# EAGLE design picstick_25k50_v1 (EAGLE 7.2.0)
pickstick - open source hardware
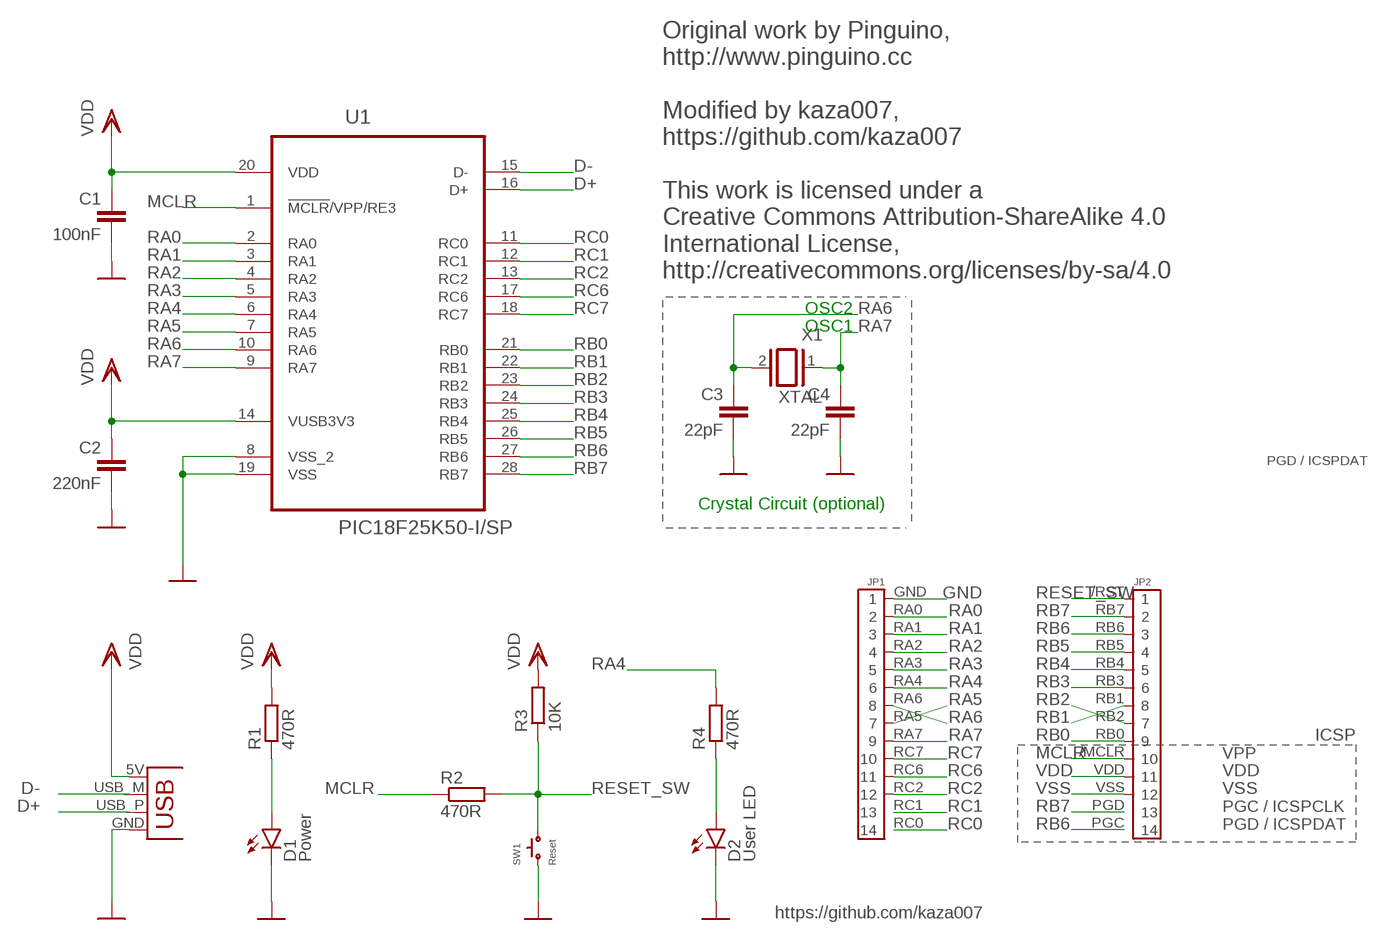
[diagram p0: schematic, sheet 1]

## Parts
C1  100nF  C-EU050-024X044  [C050-024X044]
C2  220nF  C-EU050-024X044  [C050-024X044]
C3  22pF  C-EU025-024X044  [C025-024X044]
C4  22pF  C-EU025-024X044  [C025-024X044]
D1  Power  LED3MM  [LED3MM]
D2  User LED  LED3MM  [LED3MM]
JP1  CONN-14P-PICSTICK-JP1  [PICSTICK_JP1]
JP2  CONN-14P-PICSTICK-JP2  [PICSTICK_JP2]
R1  470R  R-EU_0204/7  [0204/7]
R2  470R  R-EU_0204/7  [0204/7]
R3  10K  R-EU_0204/7  [0204/7]
R4  470R  R-EU_0204/7  [0204/7]
SW1  Reset  SKHLAAA010  [SKHLAAA010]
U1  PIC18F25K50-I/SP  [DIP254P762X406-28P]
USB  FREETRONICS-MASTER-V1_USBPCB  [FREETRONICS-MASTER-V1_USB-A-PCB]
X1  XTAL  XTAL/S  [QS]

## Nets
D+: U1.16(D+) USB.USB_P(D+)
D-: U1.15(D-) USB.USB_M(D-)
GND: C1.2 C2.2 C3.2 C4.2 D1.K(C) D2.K(C) JP1.GND SW1.1 U1.8(VSS_2) U1.19(VSS) USB.GND
MCLR: JP2./MCLR R2.1 U1.1(!MCLR!/VPP/RE3)
N$1: D1.A R1.1
N$6: D2.A R4.1
RA0: JP1.RA0 U1.2(RA0)
RA1: JP1.RA1 U1.3(RA1)
RA2: JP1.RA2 U1.4(RA2)
RA3: JP1.RA3 U1.5(RA3)
RA4: JP1.RA4 R4.2 U1.6(RA4)
RA5: JP1.RA5 U1.7(RA5)
RA6: C3.1 JP1.RA6 U1.10(RA6) X1.2
RA7: C4.1 JP1.RA7 U1.9(RA7) X1.1
RB0: JP2.RB0 U1.21(RB0)
RB1: JP2.RB1 U1.22(RB1)
RB2: JP2.RB2 U1.23(RB2)
RB3: JP2.RB3 U1.24(RB3)
RB4: JP2.RB4 U1.25(RB4)
RB5: JP2.RB5 U1.26(RB5)
RB6: JP2.PGC JP2.RB6 U1.27(RB6)
RB7: JP2.PGD JP2.RB7 U1.28(RB7)
RC0: JP1.RC0 U1.11(RC0)
RC1: JP1.RC1 U1.12(RC1)
RC2: JP1.RC2 U1.13(RC2)
RC6: JP1.RC6 U1.17(RC6)
RC7: JP1.RC7 U1.18(RC7)
RESET_SW: JP2./RST R2.2 R3.1 SW1.2
VDD: C1.1 C2.1 JP2.VDD R1.2 R3.2 U1.14(VUSB3V3) U1.20(VDD) USB.5V(VBUS)
VSS: JP2.VSS

## Notes on the sheet
- Original work by Pinguino,
  http://www.pinguino.cc
  
  Modified by kaza007,
  https://github.com/kaza007
  
  This work is licensed under a 
  Creative Commons Attribution-ShareAlike 4.0
  International License,
  http://creativecommons.org/licenses/by-sa/4.0
- OSC2
- OSC1
- PGD / ICSPDAT
- Crystal Circuit (optional)
- ICSP
- VPP
- PGC / ICSPCLK
- PGD / ICSPDAT
- https://github.com/kaza007

## Library data of the parts
C1-C4 = rcl:C-EU: CAPACITOR, European symbol
D1 D2 = gm-diodes:LED
JP1 JP2 = pinconn:CONN-14P
R1-R4 = rcl:R-EU_: RESISTOR, European symbol
SW1 = alps:SKHLAAA010
U1 = arthur:PIC18F25K50-I/SP: IC, MCU, 8BIT, 32KB FLASH, 28SPDIP; MPN: PIC18F25K50-I/SP; OC_FARNELL: 2305832; OC_NEWARK: 06W2973; PACKAGE: 28SPDIP; SUPPLIER: Microchip
USB = LeoStick:FREETRONICS-MASTER-V1_USB: USB Connectors USB-B-PTH is fully proven SKU : PRT-00139 USB-miniB is fully proven SKU : PRT-00587 USB-A-PCB is untested. USB-A-H is throughly reviewed, but untested. Spark Fun Electronics SKU : PRT-00437 USB-B-SMT is throughly reviewed, but untested. Needs silkscreen touching up. USB-A-S has not been used/tested USB-MB-H has not been used/tested
X1 = special:XTAL/S: CRYSTAL

## Net classes
0 default: clearance 0.205 mm

## Board
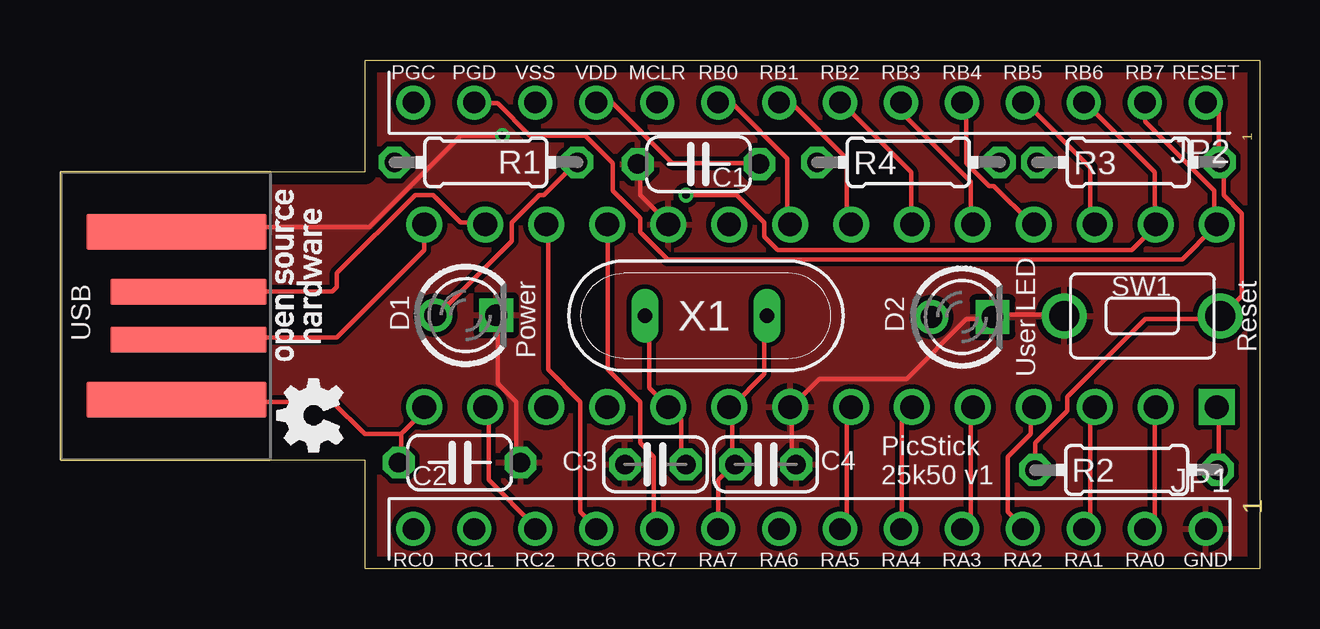
[diagram p1: board, top side]
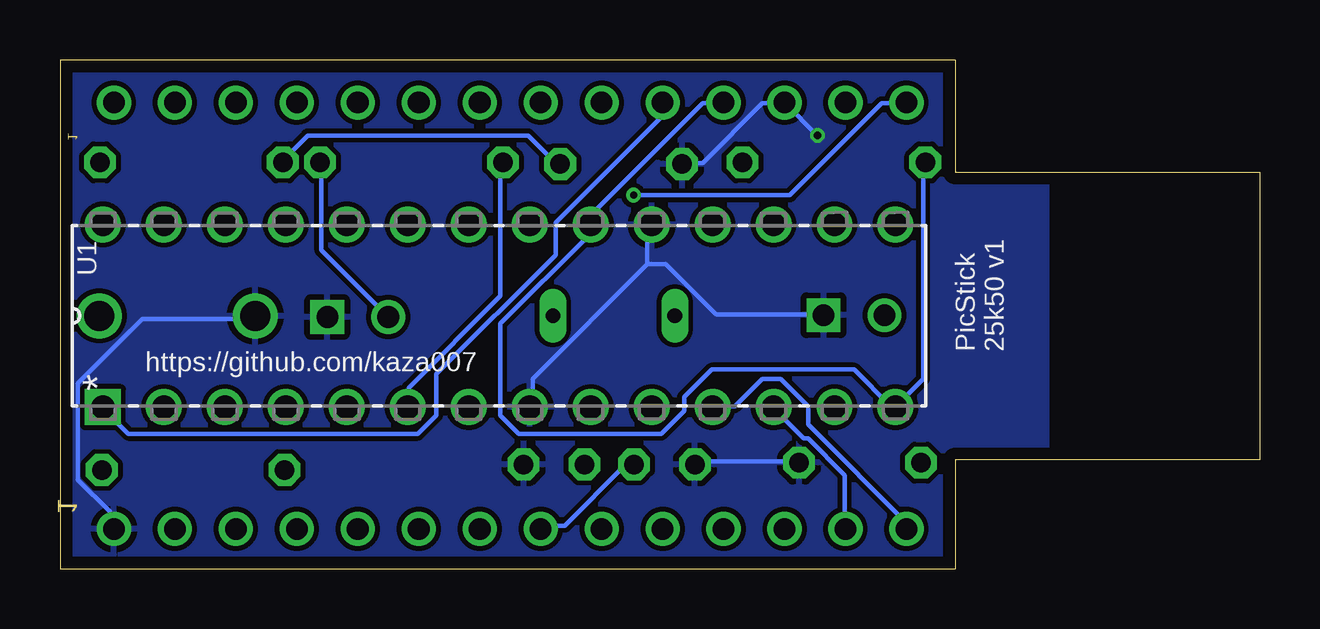
[diagram p2: board, bottom side, seen from below]

Size 49.99 x 21.21 mm. Coordinates in mm from the lower left corner, seen from the top.
Outline: 0,4.53 12.69,4.53 12.69,0 49.99,0 49.99,21.21 12.69,21.21 12.69,16.54 0,16.54 0,4.53
Outline: 0,4.53 0,4.53
Copper layers (1*16): Top 0.035mm / dielectric 1.9mm / Bottom 0.035mm
Design rules "ShenZhen2U EagleRules *": minimum track width 7mil, minimum drill 12mil, track to track 7mil, track to pad 7mil, pad to pad 7mil, via to via 7mil, smd to smd 0mil, copper to edge 20mil, drill to drill 10mil, minimum pad ring 10mil, minimum via ring 6mil, stop-mask expansion 2mil, vias tented up to drill 25mil, thermal gap 10mil

### Footprints (pad centres in the part's own frame; a part is rotated, then mirrored left to right if it is on the bottom)
C050-024X044 = drill 0.813 octagon: 1 -2.54,0; 2 2.54,0
C025-024X044 = drill 0.813 octagon: 1 -1.27,0; 2 1.27,0
LED3MM = drill 0.9: A -1.27,0 | drill 0.9 square: K 1.27,0
PICSTICK_JP1 = drill 0.9 pad 1.422: GND -17.78,0; RA0 -15.24,0; RA1 -12.7,0; RA2 -10.16,0; RA3 -7.62,0; RA4 -5.08,0; RA5 -2.54,0; RA6 0,0; RA7 2.54,0; RC0 15.24,0; RC1 12.7,0; RC2 10.16,0; RC6 7.62,0; RC7 5.08,0
PICSTICK_JP2 = drill 0.9 pad 1.422: /MCLR 5.08,0; /RST -17.78,0; PGC 15.24,0; PGD 12.7,0; RB0 2.54,0; RB1 0,0; RB2 -2.54,0; RB3 -5.08,0; RB4 -7.62,0; RB5 -10.16,0; RB6 -12.7,0; RB7 -15.24,0; VDD 7.62,0; VSS 10.16,0
0204/7 = drill 0.813 octagon: 1 -3.81,0; 2 3.81,0
SKHLAAA010 = drill 1.25: 1 -3.25,0; 2 3.25,0
DIP254P762X406-28P = drill 0.991 square: 1 -3.81,16.51 | drill 0.991: 2 -3.81,13.97; 3 -3.81,11.43; 4 -3.81,8.89; 5 -3.81,6.35; 6 -3.81,3.81; 7 -3.81,1.27; 8 -3.81,-1.27; 9 -3.81,-3.81; 10 -3.81,-6.35; 11 -3.81,-8.89; 12 -3.81,-11.43; 13 -3.81,-13.97; 14 -3.81,-16.51; 15 3.81,-16.51; 16 3.81,-13.97; 17 3.81,-11.43; 18 3.81,-8.89; 19 3.81,-6.35; 20 3.81,-3.81; 21 3.81,-1.27; 22 3.81,1.27; 23 3.81,3.81; 24 3.81,6.35; 25 3.81,8.89; 26 3.81,11.43; 27 3.81,13.97; 28 3.81,16.51
FREETRONICS-MASTER-V1_USB-A-PCB = smd 7.5 x 1.5: 5V -0.2,-3.5; GND -0.2,3.5 | smd 6.5 x 1.067: USB_M 0.3,-1; USB_P 0.3,1
QS = drill 0.61 long: 1 -2.54,0; 2 2.54,0

### Placement (x,y rotation side)
C1  26.61,16.87 180 top
C2  16.65,4.42 0 top
C3  24.81,4.34 180 top
C4  29.4,4.34 0 top
D1  16.91,10.57 0 top
D2  37.58,10.49 0 top
JP1  29.96,1.65 180 top
JP2  29.96,19.43 180 top
R1  17.74,16.94 180 top
R2  44.44,4.11 180 top
R3  44.52,16.94 180 top
R4  35.35,16.94 180 top
SW1  45.1,10.54 0 top
U1  31.69,10.54 90 bottom
USB  5.05,10.54 0 top
X1  26.91,10.54 180 top

### Tracks (layer width: path | path; a pad name or v marks a point on that pad's centre or on a via)
D+
  Top 0.178: U1.16 17.66,14.42 16.71,14.42 15.56,15.57 14.79,15.57 11.54,12.32 11.54,11.74 11.35,11.55 5.42,11.55 USB.USB_P
D-
  Top 0.178: U1.15 15.18,14.23 15.18,13.28 11.54,9.64 5.42,9.64 USB.USB_M
GND  (via drill 0.3)
  Top 0.178: SW1.1 41.78,10.6 38.91,10.6 D2.K 38.72,10.4 37.76,10.4 35.27,7.92 31.64,7.92 30.49,6.77 U1.8 30.49,6.58 30.49,4.47 C4.2 | D1.K 18.24,10.4 18.24,7.72 19,6.96 19,4.47 C2.2 | C1.2 24.17,16.72 24.17,15.57 25.32,14.42 U1.19 | v18.43,18.06 16.71,18.06 12.88,14.23 5.03,14.23 USB.GND
  Bottom 0.178: JP1.GND 47.91,1.79 47.91,2.37 49.25,3.71 49.25,7.72 46.57,10.4 41.97,10.4 SW1.1 | C2.2 19.2,4.47 23.41,4.47 C3.2 | 19.96,19.4 20.73,19.4 23.22,16.91 23.98,16.91 C1.2 | 25.51,12.7 30.3,7.92 30.3,6.77 U1.8 | 25.51,12.7 25.51,14.23 U1.19 | 25.51,12.7 24.75,12.7 22.64,10.6 18.24,10.6 D1.K | 19.77,19.4 v18.43,18.06
  Bottom 0.254: 19.96,19.4 19.77,19.4
  pour Bottom: 8.88,16.38 12.94,16.38 12.94,20.96 49.77,20.96 49.77,0.2 12.94,0.2 12.94,4.7 8.88,4.7
  pour Top: 8.88,16.38 12.94,16.38 12.94,20.96 49.77,20.96 49.77,0.2 12.94,0.2 12.94,4.7 8.88,4.7
MCLR
  Top 0.178: R2.1 48.29,4.28 48.29,6.58 U1.1
  Bottom 0.178: JP2./MCLR 24.94,19.4 24.94,18.82 29.34,14.42 29.34,13.08 34.32,8.11 34.32,6.38 35.08,5.62 47.14,5.62 48.1,6.58 U1.1
N$1
  Top 0.178: R1.1 21.49,16.91 20.15,15.57 19.96,15.57 18.81,14.42 18.81,13.66 15.75,10.6 D1.A
N$6
  Bottom 0.178: R4.1 39.1,16.91 39.1,13.28 36.42,10.6 D2.A
RA0
  Top 0.178: U1.2 45.61,6.58 45.61,2.17 45.23,1.79 JP1.RA0
RA1
  Top 0.178: U1.3 42.93,6.58 42.93,1.98 42.74,1.79 JP1.RA1
RA2
  Top 0.178: U1.4 40.44,6.58 40.44,5.62 39.48,4.66 39.48,2.37 40.06,1.79 JP1.RA2
RA3
  Top 0.178: U1.5 37.95,6.58 37.95,1.98 37.76,1.79 JP1.RA3
RA4
  Top 0.178: JP1.RA4 35.08,1.79 35.08,6.19 35.46,6.58 U1.6
  Bottom 0.178: R4.2 31.64,16.91 31.64,11.36 35.46,7.53 35.46,6.77 U1.6
RA5
  Top 0.178: U1.7 32.79,6.58 32.79,1.98 32.59,1.79 JP1.RA5
RA6
  Top 0.178: X1.2 24.55,10.4 24.55,7.53 25.32,6.77 U1.10 25.51,6.58 25.89,6.19 25.89,4.47 C3.1
  Bottom 0.178: JP1.RA6 29.91,1.79 28.96,1.79 26.47,4.28 26.09,4.28 C3.1
RA7
  Top 0.178: X1.1 29.34,10.4 29.34,8.11 28,6.77 U1.9 28,6.58 28,4.47 C4.1 28,4.28 27.43,3.71 27.43,1.79 JP1.RA7
RB0
  Top 0.178: U1.21 30.3,14.42 30.3,17.1 28,19.4 27.43,19.4 JP2.RB0
RB1
  Top 0.178: U1.22 32.79,14.42 32.79,17.1 30.49,19.4 30.11,19.4 JP2.RB1
RB2
  Top 0.178: U1.23 35.46,14.42 35.46,16.53 32.59,19.4 JP2.RB2
RB3
  Top 0.178: U1.24 37.95,14.42 37.95,16.15 35.08,19.02 35.08,19.4 JP2.RB3
RB4
  Top 0.178: U1.25 40.44,14.42 38.91,15.95 38.72,15.95 37.76,16.91 37.76,19.4 JP2.RB4
RB5
  Top 0.178: U1.26 42.93,14.42 42.93,16.72 40.25,19.4 JP2.RB5
RB6  (via drill 0.3)
  Top 0.178: JP2.RB6 42.74,19.4 45.61,16.53 45.61,14.42 U1.27 45.61,14.23 44.65,13.28 29.91,13.28 29.34,13.85 29.34,14.42 28.19,15.57 v26.09,15.57
  Bottom 0.178: v26.09,15.57 19.58,15.57 15.75,19.4 14.79,19.4 JP2.PGC
RB7
  Top 0.178: JP2.RB7 45.23,19.4 45.23,18.63 48.1,15.76 48.1,14.42 U1.28 48.1,14.23 46.76,12.89 25.32,12.89 24.17,14.04 24.17,14.61 23.02,15.76 23.02,16.91 21.88,18.06 19.58,18.06 18.24,19.4 17.28,19.4 JP2.PGD
RC0
  Bottom 0.178: U1.11 22.64,6.77 21.88,6.77 20.73,7.92 19.96,7.92 18.81,6.77 18.81,6 14.6,1.79 JP1.RC0
RC1
  Bottom 0.178: U1.12 20.15,6.58 19,5.43 18.81,5.43 17.28,3.9 17.28,1.79 JP1.RC1
RC2
  Top 0.178: U1.13 17.86,6.58 17.86,3.71 19.77,1.79 JP1.RC2
RC6
  Top 0.178: U1.17 20.34,14.23 20.34,8.3 21.68,6.96 21.68,2.37 22.26,1.79 JP1.RC6
RC7
  Top 0.178: U1.18 22.83,14.23 22.83,8.3 24.17,6.96 24.17,5.24 24.75,4.66 24.75,1.79 JP1.RC7
RESET_SW
  Top 0.178: JP2./RST 47.91,19.4 48.29,19.02 48.29,17.1 R3.1 48.48,16.91 48.48,15.57 49.25,14.81 49.25,11.36 48.48,10.6 SW1.2 48.29,10.4 45.23,10.4 41.97,7.15 41.97,6.58 40.63,5.24 40.63,4.28 R2.2
VDD
  Top 0.178: C1.1 29.15,16.91 25.51,16.91 23.02,19.4 22.45,19.4 JP2.VDD | 14.22,5.62 14.22,4.47 C2.1 | 14.22,5.62 15.18,6.58 U1.14 | 14.22,5.62 12.69,5.62 11.35,6.96 5.03,6.96 USB.5V
  Bottom 0.178: R3.2 40.63,17.1 39.68,18.06 30.49,18.06 29.34,16.91 C1.1 | JP2.VDD 22.45,19.4 23.22,19.4 27.81,14.81 27.81,14.42 U1.20 28,14.23 28,13.85 31.64,10.21 31.64,6.38 30.87,5.62 24.94,5.62 23.98,6.58 23.98,7.15 22.83,8.3 16.9,8.3 15.37,6.77 U1.14 15.18,6.77 14.03,7.92 14.03,16.91 R1.2

### Text on the board
tPlace: SW1 | Power | Reset | User LED | PicStick / 25k50 v1
bPlace: PicStick / 25k50 v1 | https://github.com/kaza007